# Altium schematic sheet ETHER.SchDoc
size A; SheetNumber: 4; SheetTotal: 7
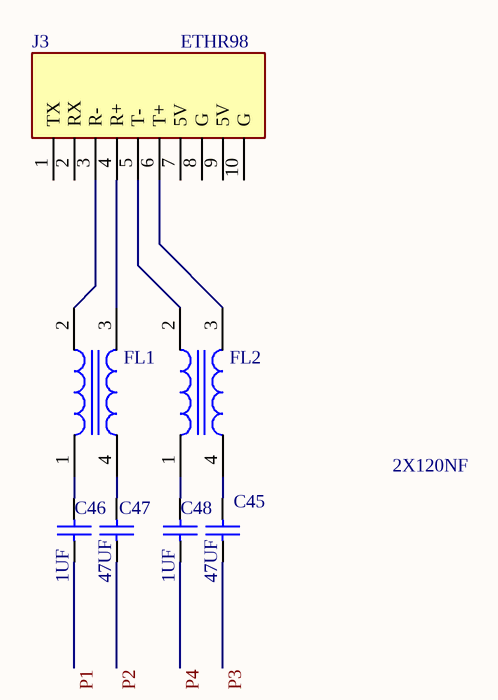
[diagram p0: ETHER.SchDoc]

## Parts
C45  47UF  [CAPC1005X56X25LL10T15]
C46  1UF  [CAPC1005X56X25LL10T15]
C47  47UF  [CAPC1005X56X25LL10T15]
C48  1UF  [CAPC1005X56X25LL10T15]
FL1  B82789C0513N002  [FL_B82789C0513N002]  (value not drawn)
FL2  B82789C0513N002  [FL_B82789C0513N002]  (value not drawn)
J3  ETHR98

## Nets
P1: C46.1
P2: C47.1
P3: C45.1
P4: C48.1
NetC45_2: C45.2 FL2.4
NetC46_2: C46.2 FL1.1
NetC47_2: C47.2 FL1.4
NetC48_2: C48.2 FL2.1
NetFL1_2: FL1.2 J3.3(R-)
NetFL1_3: FL1.3 J3.4(R+)
NetFL2_2: FL2.2 J3.5(T-)
NetFL2_3: FL2.3 J3.6(T+)

Not connected (* = marked no-connect by the designer): J3 1(TX) 2(RX) 7(5V) 8(G) 9(5V) 10(G)

## Notes on the sheet
- 2X120NF

## Library data of the parts
C45-C48 = CMP-2008-02962-1
  C45 C47: VALUE: 47UF
  C46 C48: VALUE: 1UF
FL1 FL2 = B82789C0513N002: 51 ÂµH @ 100 kHz 2 Line Common Mode Choke Surface Mount 250mA DCR 550mOhm; MF: EPCOS; SnapEDA_Link: https://www.snapeda.com/parts/B82789C0513N002/EPCOS/view-part/?ref=snap; Package: NON STANDARD-4 TDK; Value: *; MP: B82789C0513N002; Check_prices: https://www.snapeda.com/parts/B82789C0513N002/EPCOS/view-part/?ref=eda